# EAGLE design mixtape2 (EAGLE 6.49)
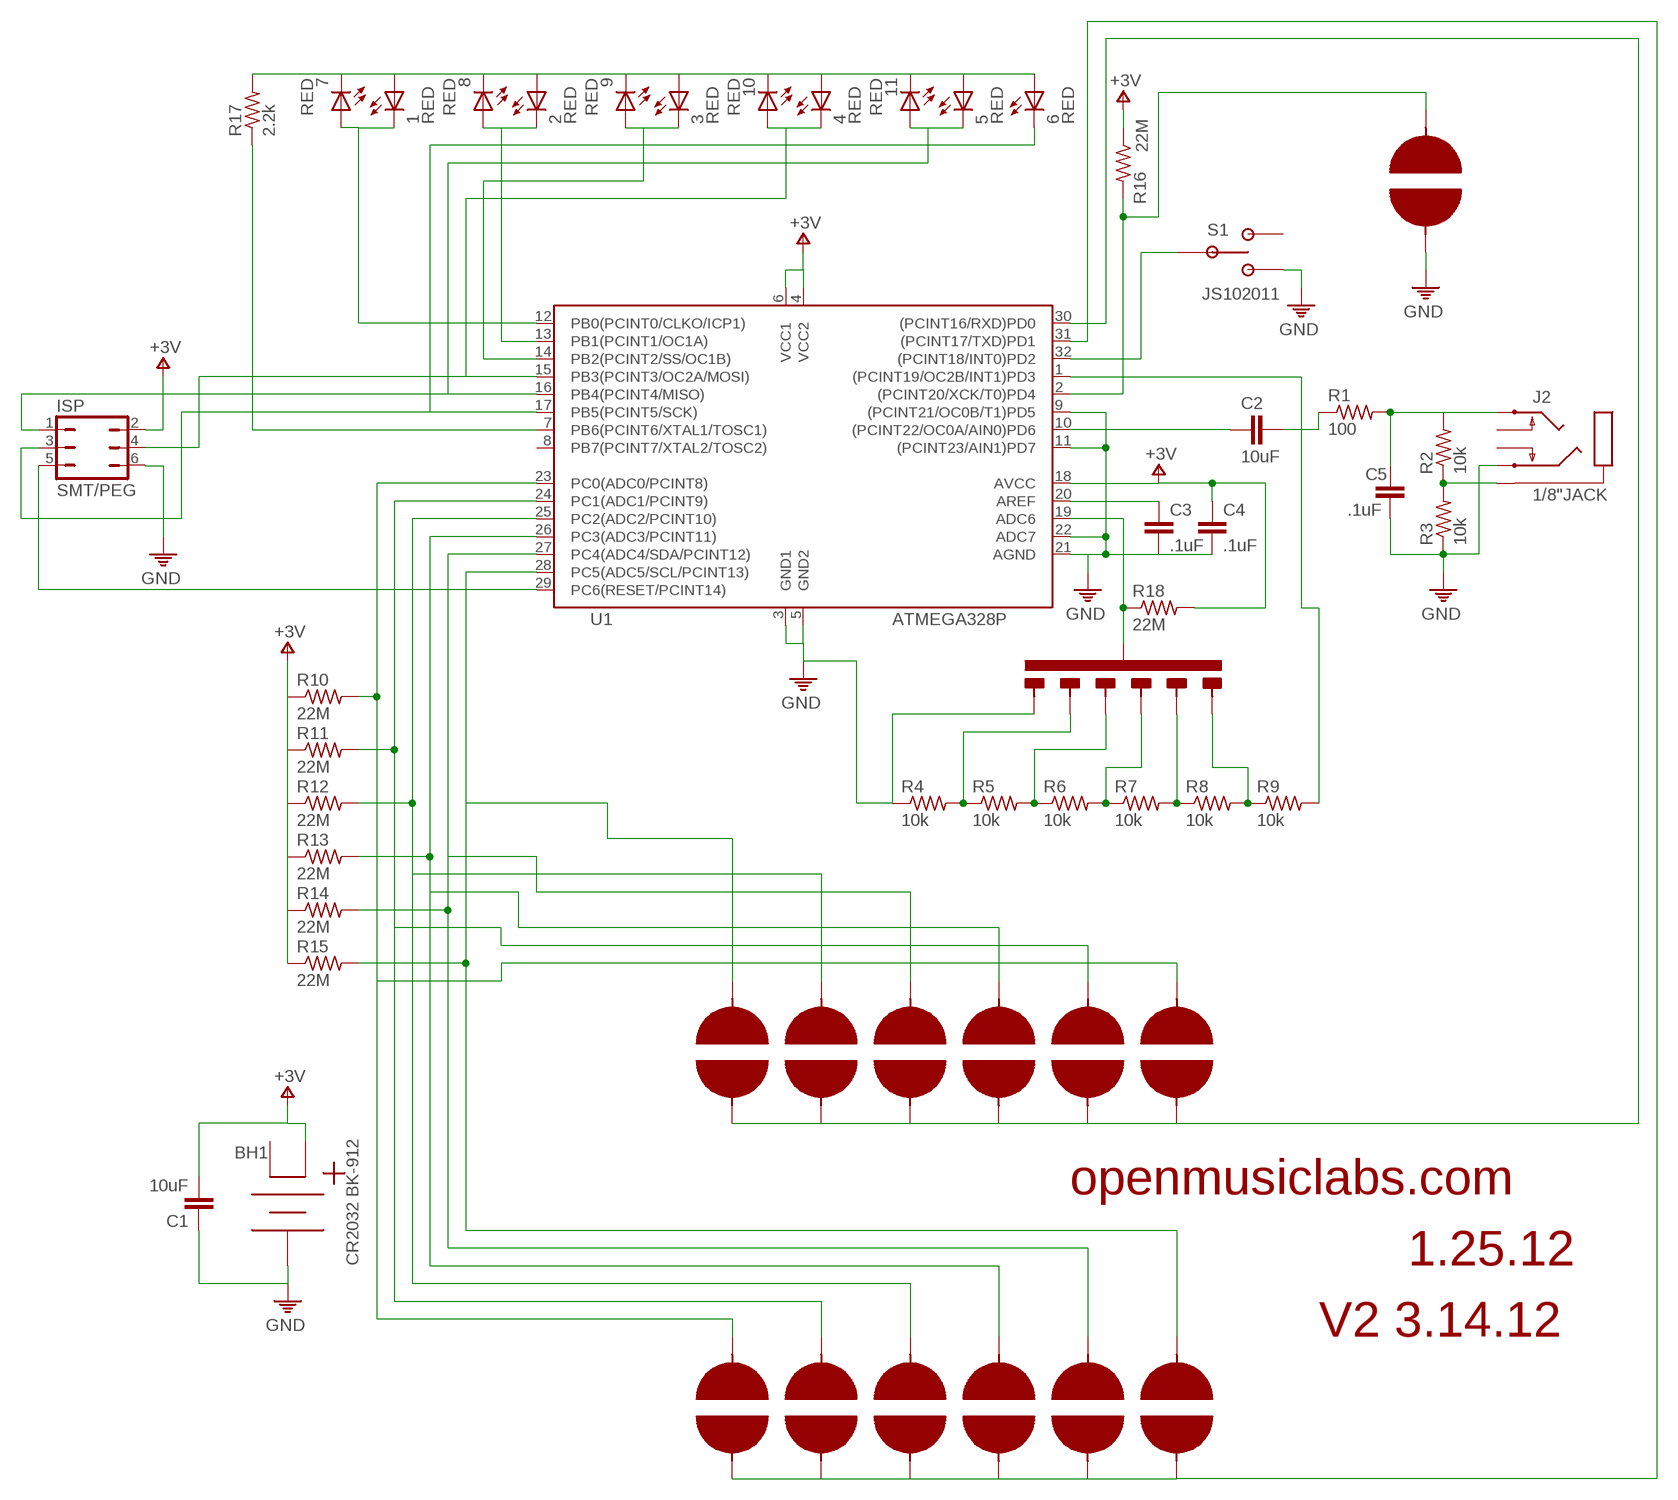
[diagram p0: schematic, sheet 1]

## Parts
1  RED  LEDLUMEX-92-21  [LED-SMT-91-21]
2  RED  LEDLUMEX-92-21  [LED-SMT-91-21]
3  RED  LEDLUMEX-92-21  [LED-SMT-91-21]
4  RED  LEDLUMEX-92-21  [LED-SMT-91-21]
5  RED  LEDLUMEX-92-21  [LED-SMT-91-21]
6  RED  LEDLUMEX-92-21  [LED-SMT-91-21]
7  RED  LEDLUMEX-92-21  [LED-SMT-91-21]
8  RED  LEDLUMEX-92-21  [LED-SMT-91-21]
9  RED  LEDLUMEX-92-21  [LED-SMT-91-21]
10  RED  LEDLUMEX-92-21  [LED-SMT-91-21]
11  RED  LEDLUMEX-92-21  [LED-SMT-91-21]
BH1  CR2032 BK-912  BAT-HOLDCR2032-BK-912  [BAT-HOLD-BK-912]
C1  10uF  CAPACITOR0805-SM  [0805/SMALL]
C2  10uF  CAPACITOR0805-SM  [0805/SMALL]
C3  .1uF  CAPACITOR0603=SM  [0603-SM]
C4  .1uF  CAPACITOR0603=SM  [0603-SM]
C5  .1uF  CAPACITOR0603=SM  [0603-SM]
ISP  SMT/PEG  JMP/6P/DIPSMT/PEG  [JMP/6P/DIP/SMT/PEG]
J2  1/8"JACK  1/8"JACK/STEREO/2SWITCHCUI3515/KOBICONN2805  [1/8"JACK/STEREO/SMT]
R1  100  RESISTOR0603-SM  [0603-SM]
R2  10k  RESISTOR0603-SM  [0603-SM]
R3  10k  RESISTOR0603-SM  [0603-SM]
R4  10k  RESISTOR0603-SM  [0603-SM]
R5  10k  RESISTOR0603-SM  [0603-SM]
R6  10k  RESISTOR0603-SM  [0603-SM]
R7  10k  RESISTOR0603-SM  [0603-SM]
R8  10k  RESISTOR0603-SM  [0603-SM]
R9  10k  RESISTOR0603-SM  [0603-SM]
R10  22M  RESISTOR0603-SM  [0603-SM]
R11  22M  RESISTOR0603-SM  [0603-SM]
R12  22M  RESISTOR0603-SM  [0603-SM]
R13  22M  RESISTOR0603-SM  [0603-SM]
R14  22M  RESISTOR0603-SM  [0603-SM]
R15  22M  RESISTOR0603-SM  [0603-SM]
R16  22M  RESISTOR0603-SM  [0603-SM]
R17  2.2k  RESISTOR0603-SM  [0603-SM]
R18  22M  RESISTOR0603-SM  [0603-SM]
S1  JS102011  SWITCH/SPDT/NOMECHJS102011  [SWITCH/SLIDE/JS102011]
U1  ATMEGA328P  [32-TQFP-NOMOD]
U$1  PAD/TOUCH/WHEEL  [PAD/TOUCH/WHEEL]
U$2  PAD/TOUCH  [PAD/TOUCH/DOT]
U$3  PAD/TOUCH  [PAD/TOUCH/DOT]
U$4  PAD/TOUCH  [PAD/TOUCH/DOT]
U$5  PAD/TOUCH  [PAD/TOUCH/DOT]
U$6  PAD/TOUCH  [PAD/TOUCH/DOT]
U$7  PAD/TOUCH  [PAD/TOUCH/DOT]
U$8  PAD/TOUCH  [PAD/TOUCH/DOT]
U$9  PAD/TOUCH/SLIDERSLIDER  [PAD/TOUCH/SLIDER]

## Nets
N$1: R17.P$1 U1.7(PB6(PCINT6/XTAL1/TOSC1))
N$2: U1.31((PCINT17/TXD)PD1) U$2.P$2 U$3.P$2 U$4.P$2 U$5.P$2 U$6.P$2 U$7.P$2
N$3: R13.P$2 U1.26(PC3(ADC3/PCINT11)) U$1.P$7 U$5.P$1
N$4: U1.30((PCINT16/RXD)PD0) U$1.P$2 U$1.P$4 U$1.P$6 U$1.P$8 U$1.P$10 U$1.P$12
N$5: ISP.5 U1.29(PC6(RESET/PCINT14))
N$6: J2.P$1 R2.P$1 R3.P$2
N$7: C2.1 R1.P$1
N$8: C5.P$1 J2.P$5 R1.P$2 R2.P$2
N$9: C2.2 U1.10((PCINT22/OC0A/AIN0)PD6)
N$10: S1.P$2 U1.32((PCINT18/INT0)PD2)
N$11: C3.P$1 U1.20(AREF)
N$12: R4.P$2 R5.P$1 U$9.P$6
N$13: R5.P$2 R6.P$1 U$9.P$5
N$14: R6.P$2 R7.P$1 U$9.P$4
N$15: R8.P$2 R9.P$1 U$9.P$2
N$17: R9.P$2 U1.1((PCINT19/OC2B/INT1)PD3)
N$18: 1.P$1(C) 7.P$2(A) U1.12(PB0(PCINT0/CLKO/ICP1))
N$19: 2.P$1(C) 8.P$2(A) U1.13(PB1(PCINT1/OC1A))
N$20: 3.P$1(C) 9.P$2(A) U1.14(PB2(PCINT2/SS/OC1B))
N$21: 4.P$1(C) 10.P$2(A) ISP.4 U1.15(PB3(PCINT3/OC2A/MOSI))
N$22: 5.P$1(C) 11.P$2(A) ISP.1 U1.16(PB4(PCINT4/MISO))
N$23: 1.P$2(A) 2.P$2(A) 3.P$2(A) 4.P$2(A) 5.P$2(A) 6.P$2(A) 7.P$1(C) 8.P$1(C) 9.P$1(C) 10.P$1(C) 11.P$1(C) R17.P$2
N$24: R16.P$2 U1.2((PCINT20/XCK/T0)PD4) U$8.P$1
N$26: R12.P$2 U1.25(PC2(ADC2/PCINT10)) U$1.P$3 U$4.P$1
N$27: R14.P$2 U1.27(PC4(ADC4/SDA/PCINT12)) U$1.P$5 U$6.P$1
N$30: R15.P$2 U1.28(PC5(ADC5/SCL/PCINT13)) U$1.P$1 U$7.P$1
N$31: R18.P$1 U1.19(ADC6) U$9.P$1
N$32: 6.P$1(C) ISP.3 U1.17(PB5(PCINT5/SCK))
N$35: R11.P$2 U1.24(PC1(ADC1/PCINT9)) U$1.P$9 U$3.P$1
N$37: R10.P$2 U1.23(PC0(ADC0/PCINT8)) U$1.P$11 U$2.P$1
N$100: R7.P$2 R8.P$1 U$9.P$3
PE: BH1.P$3 C1.1 C3.P$2 C4.P$2 C5.P$2 ISP.6 J2.P$3 R3.P$1 R4.P$1 S1.P$1 U1.3(GND1) U1.5(GND2) U1.9((PCINT21/OC0B/T1)PD5) U1.11((PCINT23/AIN1)PD7) U1.21(AGND) U1.22(ADC7) U$8.P$2 U$9.P$7 ; supply symbol labelled GND
V+: BH1.P$1 C1.2 C4.P$1 ISP.2 R10.P$1 R11.P$1 R12.P$1 R13.P$1 R14.P$1 R15.P$1 R16.P$1 R18.P$2 U1.4(VCC2) U1.6(VCC1) U1.18(AVCC) ; supply symbol labelled +3V
Unconnected: BH1.P$2 J2.P$2 J2.P$4 S1.P$3 U1.8(PB7(PCINT7/XTAL2/TOSC2))

## Notes on the sheet
- openmusiclabs.com
- 1.25.12
- V2 3.14.12

## Library data of the parts
1-11 = audioint:LED
BH1 = audioint:BAT-HOLD
C1-C5 = audioint:CAPACITOR
ISP = audioint:JMP/6P/DIP
J2 = audioint:1/8"JACK/STEREO/2SWITCH
R1-R18 = audioint:RESISTOR
S1 = audioint:SWITCH/SPDT/NOMECH
U1 = audioint:ATMEGA328P
U$1 = audioint:PAD/TOUCH/WHEEL
U$2-U$8 = audioint:PAD/TOUCH
U$9 = audioint:PAD/TOUCH/SLIDER

## Board
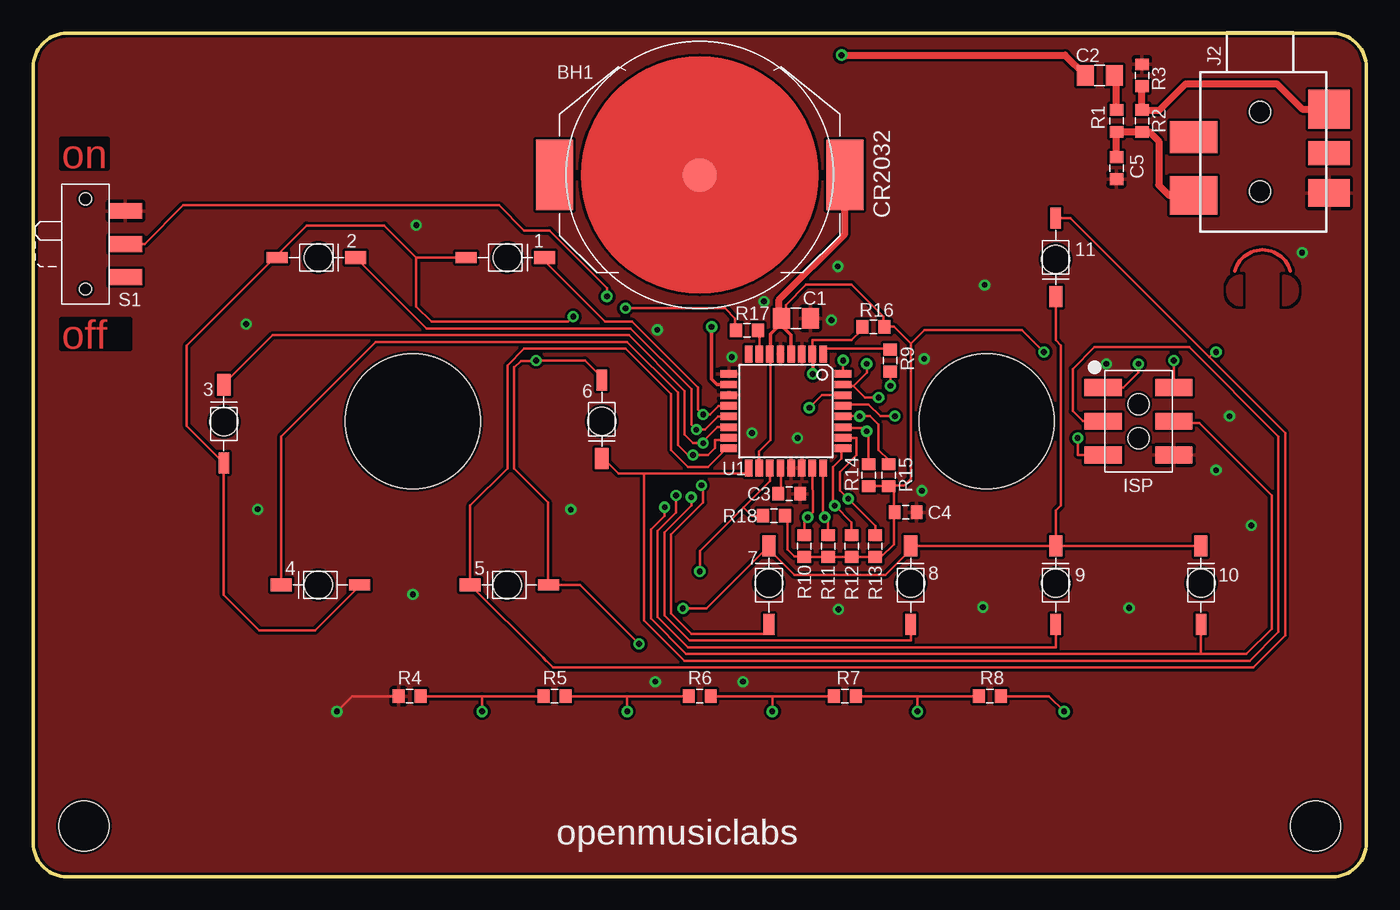
[diagram p1: board, top side]
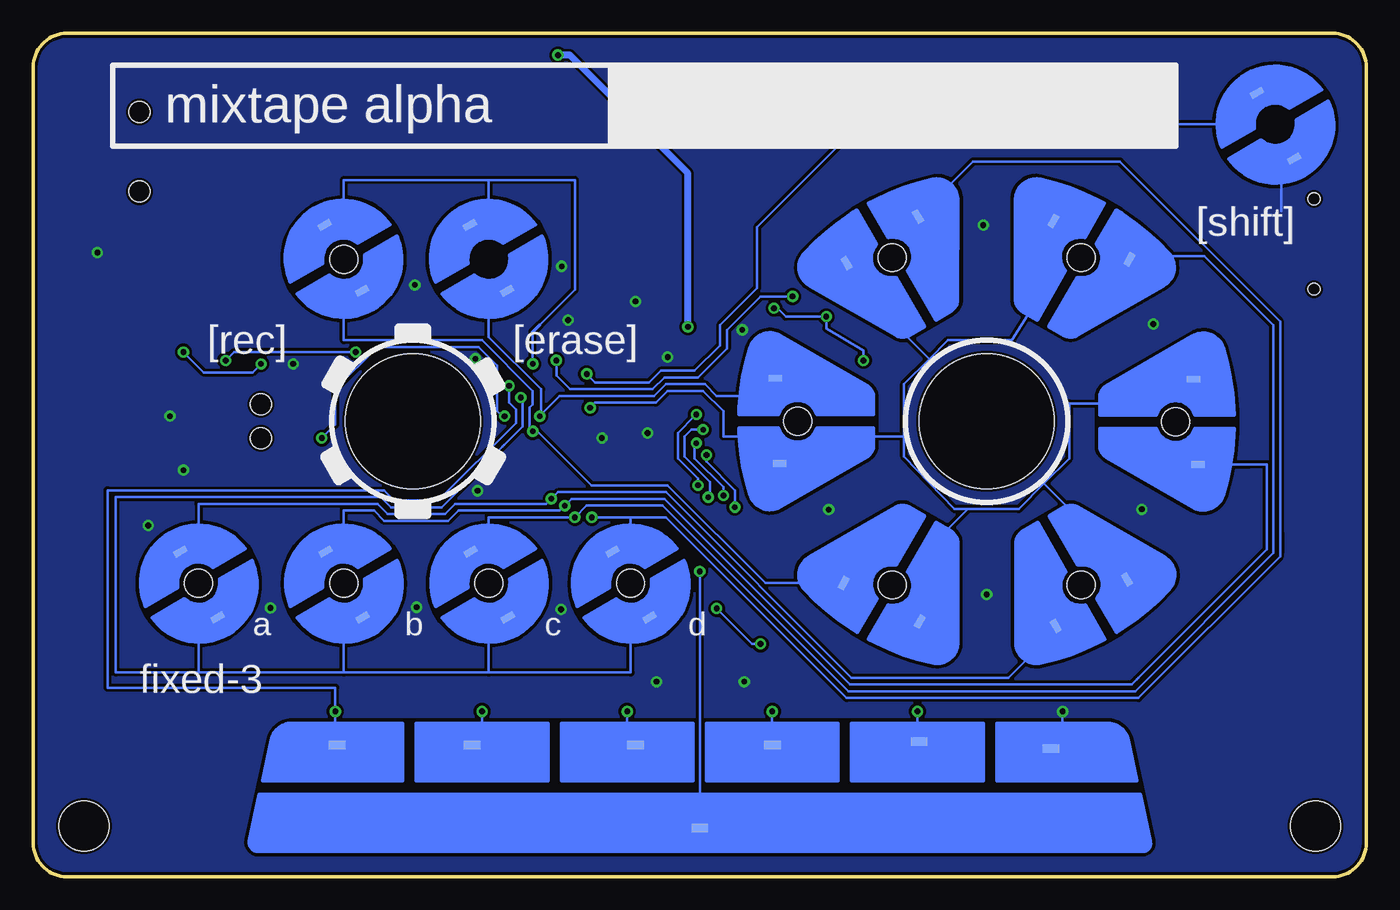
[diagram p2: board, bottom side, seen from below]

Size 100.33 x 63.5 mm. Coordinates in mm from the lower left corner, seen from the top.
Outline: 100.33,60.96 arc90 97.79,63.5 2.54,63.5 arc90 0,60.96 0,2.54 arc90 2.54,0 97.79,0 arc90 100.33,2.54 100.33,60.96
Copper layers (1*16): Top 0.035mm / dielectric 1.5mm / Bottom 0.035mm
Design rules "default": minimum track width 8mil, minimum drill 16mil, track to track 8mil, track to pad 8mil, pad to pad 8mil, via to via 8mil, smd to smd 8mil, copper to edge 8mil, drill to drill 8mil, minimum pad ring 8mil, minimum via ring 8mil, stop-mask expansion 4mil, vias tented up to drill 100mil, thermal gap 10mil
Holes 10.16 mm at 28.57,34.29 71.75,34.29
Holes 3.78 mm at 3.81,3.81 96.52,3.81

### Footprints (pad centres in the part's own frame; a part is rotated, then mirrored left to right if it is on the bottom)
LED-SMT-91-21 = smd 1.6 x 1: P$1 -2.8,0 | smd 1.6 x 0.8: P$2 3.1,0 | hole 2.108: 0,0
BAT-HOLD-BK-912 = smd 2.794 x 5.334: P$1 -10.922,0; P$2 10.922,0 | smd 2.54 x 2.54: P$3 0,0
0805/SMALL = smd 1.27 x 1.524: 1 -1.091,0; 2 1.091,0
0603-SM = smd 0.889 x 1.016: P$1 -0.826,0; P$2 0.826,0
JMP/6P/DIP/SMT/PEG = smd 1.27 x 2.794: 1 -2.54,-2.667; 2 -2.54,2.667; 3 0,-2.667; 4 0,2.667; 5 2.54,-2.667; 6 2.54,2.667 | hole 1.6: -1.27,0; 1.27,0
1/8"JACK/STEREO/SMT = smd 3.1 x 2.9: P$1 5.2,-2.8 | smd 3.1 x 1.8: P$2 5.2,-6.1 | smd 3.1 x 2.1: P$3 5.2,-9.1 | smd 3.6 x 2.4: P$4 -5,-4.9 | smd 3.6 x 2.9: P$5 -5,-9.3 | hole 1.6: 0,-9; 0,-3
SWITCH/SLIDE/JS102011 = smd 1.2 x 2.5: P$1 -2.5,3; P$2 0,3; P$3 2.5,3 | hole 0.889: -3.4,0; 3.4,0
32-TQFP-NOMOD = smd 1.27 x 0.559: 1 -4.293,2.8; 2 -4.293,2; 3 -4.293,1.2; 4 -4.293,0.4; 5 -4.293,-0.4; 6 -4.293,-1.2; 7 -4.293,-2; 8 -4.293,-2.8; 17 4.293,-2.8; 18 4.293,-2; 19 4.293,-1.2; 20 4.293,-0.4; 21 4.293,0.4; 22 4.293,1.2; 23 4.293,2; 24 4.293,2.8 | smd 0.559 x 1.27: 9 -2.8,-4.293; 10 -2,-4.293; 11 -1.2,-4.293; 12 -0.4,-4.293; 13 0.4,-4.293; 14 1.2,-4.293; 15 2,-4.293; 16 2.8,-4.293; 25 2.8,4.293; 26 2,4.293; 27 1.2,4.293; 28 0.4,4.293; 29 -0.4,4.293; 30 -1.2,4.293; 31 -2,4.293; 32 -2.8,4.293
PAD/TOUCH/WHEEL = smd 1.016 x 0.508: P$1 -15.926,3.226; P$2 -15.57,-3.175; P$3 15.926,-3.251; P$4 15.57,3.15 | smd 1.016 x 0.508 rotated 60: P$5 -10.753,-12.187; P$6 -5.032,-15.079 | smd 1.016 x 0.508 rotated 120: P$7 5.198,-15.413; P$8 10.564,-11.904 | smd 1.016 x 0.508 rotated 240: P$9 10.753,12.187; P$10 5.032,15.079 | smd 1.016 x 0.508 rotated 300: P$11 -5.173,15.413; P$12 -10.538,11.904
PAD/TOUCH/DOT = smd 1.016 x 0.508 rotated 30: P$1 -1.371,2.376; P$2 1.429,-2.577
PAD/TOUCH/SLIDER = smd 1.27 x 0.635: P$1 0,-3.048; P$2 -27.305,3.175; P$3 -17.145,3.175; P$4 -4.826,3.175; P$5 5.461,3.175; P$6 16.51,3.429; P$7 26.416,2.921

### Placement (x,y rotation side)
1  35.69,46.61 180 top
2  21.46,46.61 180 top
3  14.35,34.24 270 top
4  21.46,21.97 0 top
5  35.69,21.97 0 top
6  42.8,34.29 90 top
7  55.37,22.1 270 top
8  66.04,22.1 270 top
9  76.96,22.1 270 top
10  87.88,22.1 270 top
11  76.96,46.48 90 top
BH1  50.16,52.83 180 top
C1  57.4,42.04 180 top
C2  80.26,60.33 180 top
C3  56.9,28.83 0 top
C4  65.66,27.43 0 top
C5  81.53,53.34 270 top
ISP  83.19,34.29 270 top
J2  92.33,60.58 0 top
R1  81.53,56.9 270 top
R2  83.44,56.9 270 top
R3  83.44,60.33 270 top
R4  28.32,13.59 0 top
R5  39.24,13.59 0 top
R6  50.16,13.59 0 top
R7  61.09,13.59 0 top
R8  72.01,13.59 0 top
R9  64.52,38.86 90 top
R10  58.04,24.89 90 top
R11  59.82,24.89 90 top
R12  61.59,24.89 90 top
R13  63.37,24.89 90 top
R14  62.87,30.23 90 top
R15  64.39,30.23 90 top
R16  63.25,41.4 180 top
R17  100  [0603-SM]  53.72,41.15 180 top
R18  55.75,27.18 0 top
S1  3.94,47.62 270 top
U1  56.64,35.05 270 top
U$1  28.57,34.29 0 bottom
U$2  55.37,22.1 0 bottom
U$3  66.04,22.1 0 bottom
U$4  76.96,22.1 0 bottom
U$5  87.88,22.1 0 bottom
U$6  76.96,46.48 180 bottom
U$7  66.04,46.48 180 bottom
U$8  6.86,56.64 0 bottom
U$9  50.16,6.73 0 bottom

### Tracks (layer width: path | path; a pad name or v marks a point on that pad's centre or on a via)
N$1
  Top 0.203: R17.P$1 54.55,41.08 54.61,41.15 54.64,41.12 U1.7
N$2  (via drill 0.43, 0.43 pad 0.86)
  Top 0.203: U1.31 60.94,36.96 61.72,36.96 | v62.74,38.61 62.74,37.97 61.72,36.96 | v63.63,36.07 62.61,36.07 61.72,36.96
  Bottom 0.203: U$7.P$2 66.04,49.06 66.04,52.45 | 78.36,49.06 78.36,49.02 | 78.36,49.06 U$6.P$2 | 78.36,49.06 78.36,49.15 76.96,49.15 76.96,52.45 66.04,52.45 | U$2.P$2 55.37,19.52 55.37,15.37 66.04,15.37 | 86.36,19.52 86.36,19.56 | 86.36,19.52 U$5.P$2 | 86.36,19.52 86.36,18.16 87.88,18.16 87.88,15.37 88.01,15.37 | U$3.P$2 66.04,19.52 66.04,15.37 | 66.04,52.45 59.56,52.45 59.56,44.2 62.23,41.53 | v62.74,38.61 62.74,41.02 | 88.01,15.37 94.11,15.37 94.11,28.57 74.17,28.57 73.41,27.81 69.6,27.81 65.02,32.38 | 65.02,32.38 64.9,32.51 | 66.04,15.37 76.96,15.37 | 76.96,15.37 88.01,15.37 | U$4.P$2 76.96,19.52 76.96,15.37 | 65.02,32.38 63.5,33.91 63.5,35.43 63.5,35.94 v63.63,36.07
  Bottom 0.254: 62.74,41.02 62.23,41.53
N$3  (via drill 0.43 pad 0.86)
  Top 0.203: 60.55,33.02 60.45,33.02 | 60.55,33.02 U1.26 | 60.55,33.02 61.98,33.02 61.98,31.75 60.71,30.48 60.71,29.08 v61.34,28.45 63.37,26.42 R13.P$2
  Bottom 0.203: U$5.P$1 87.88,24.47 87.88,28.07 74.42,28.07 73.66,27.3 69.34,27.3 68.58,28.07 61.72,28.07 v61.34,28.45 60.83,28.96 52.7,28.96 38.73,14.99 26.92,14.99 23.45,18.46 23.45,20.15 | 23.45,20.15 U$1.P$7 | 23.45,20.15 22.99,19.68
N$4  (via drill 0.43 pad 0.86)
  Top 0.203: U1.30 59.37,36.25 v58.42,35.31
  Bottom 0.203: U$1.P$10 23.62,49.4 23.24,45.47 23.62,45.47 23.62,45.21 26.67,40.39 31.5,40.39 32.89,38.99 | U$1.P$12 38.95,46.19 35.94,44.2 35.94,42.04 32.89,38.99 | U$1.P$6 33.15,19.67 33.15,21.34 | 33.15,21.34 33.15,23.24 | U$1.P$8 20.83,24.26 | 20.83,24.26 20.7,24.51 | 32.89,38.99 34.8,37.08 34.8,33.15 | 22.35,35.33 22.35,31.5 24.26,29.59 | 22.35,35.33 22.35,35.56 | 34.8,33.15 40.01,33.15 40.64,32.51 40.64,31.11 U$1.P$2 46.18,33.15 48.39,33.15 48.39,35.05 49.91,36.58 52.58,36.58 53.47,35.69 58.04,35.69 v58.42,35.31 | 34.8,33.15 34.8,31.62 30.99,27.69 29.97,27.69 | 29.97,27.69 26.16,27.69 24.26,29.59 | 20.83,24.26 20.95,24.13 20.95,26.29 24.26,29.59 | 33.15,21.34 33.4,21.34 | 33.15,21.34 33.15,24.51 29.97,27.69 | 16.61,35.64 22.35,35.64 22.35,35.33
  Bottom 0.254: U$1.P$4 16.61,37.44 16.61,35.64
N$5  (via drill 0.43)
  Top 0.203: U1.29 61.04,35.56 62.87,35.56 63.75,34.67 v64.85,34.67 | ISP.5 78.61,31.75 v78.61,33.02
  Bottom 0.203: 64.9,34.67 v64.85,34.67 65.02,34.67 65.41,35.05 65.41,38.48 66.8,39.88 74.42,39.88 77.6,36.7 77.6,34.04 v78.61,33.02
N$6
  Top 0.508: J2.P$1 arc-90 J2.P$1 | J2.P$1 arc-90 97.47,57.72 | R2.P$1 83.44,57.66 | R2.P$1 R3.P$2 | R2.P$1 84.77,57.72 86.74,59.69 93.6,59.69 95.5,57.78 J2.P$1 | J2.P$1 | J2.P$1
N$7
  Top 0.508: 81.53,57.66 R1.P$1 81.53,60.33 C2.1
N$8
  Top 0.508: 83.5,56.07 arc-90 83.57,56.01 arc90 83.5,56.07 | R2.P$2 83.5,56.07 | R2.P$2 R1.P$2 C5.P$1 | R2.P$2 84.01,56.07 84.71,55.37 84.71,52.07 85.47,51.31 87.25,51.31 arc-90 87.38,51.18 arc-90 87.33,51.23 J2.P$5
N$9  (via drill 0.43 pad 0.86)
  Top 0.254: U1.10 52.04,37.05 | 52.04,37.05 51.47,37.05 51.05,37.47 v51.05,41.4 | 52.04,37.05 52.07,37.08
  Top 0.508: C2.2 79.12,60.33 | C2.2 79.25,60.33 | C2.2 77.65,61.85 v60.83,61.85
  Bottom 0.508: v51.05,41.4 51.05,52.96 59.94,61.85 v60.83,61.85
N$10  (via drill 0.43 pad 0.86)
  Top 0.203: S1.P$2 8.38,47.62 11.3,50.55 35.05,50.55 36.96,48.64 38.86,48.64 43.18,44.32 v43.18,43.69 | 60.84,37.85 U1.32 60.96,37.85 v60.96,38.86
  Bottom 0.203: v43.18,43.69 45.59,43.69 48.13,41.15 48.13,39.75 50.29,37.59 52.83,37.59 53.72,36.7 59.94,36.7 60.96,37.72 v60.96,38.86
N$11
  Top 0.203: C3.P$1 56.26,28.83 56.26,30.74 U1.20
N$12  (via drill 0.43 pad 0.86)
  Top 0.203: R4.P$2 33.78,13.59 | 33.78,13.59 R5.P$1 | 33.78,13.59 v33.78,12.45
  Bottom 0.203: v33.78,12.45 33.78,10.52 33.78,10.29
  Bottom 0.406: 33.78,10.52 33.68,10.52 33.68,10.16 U$9.P$6
N$13  (via drill 0.43 pad 0.86)
  Top 0.203: 49.4,13.59 R6.P$1 44.7,13.59 | R5.P$2 44.7,13.59 | 44.7,13.59 v44.7,12.45
  Bottom 0.203: 44.73,12.45 44.73,12.52 | v44.7,12.45 44.73,12.45 | U$9.P$5 44.73,9.91 44.73,12.45
N$14  (via drill 0.43 pad 0.86)
  Top 0.203: v55.63,12.45 55.63,13.59 | 51,13.59 R6.P$2 50.65,13.59 | 55.63,13.59 51,13.59 | 55.63,13.59 R7.P$1 | 51,13.59 51,13.61 | 55.63,13.59 50.65,13.59 | 50.65,13.59 50.65,13.51
  Bottom 0.203: U$9.P$4 55.63,10.54 v55.63,12.45
N$15  (via drill 0.43 pad 0.86)
  Top 0.203: v77.6,12.45 76.45,13.59 72.75,13.59 | 72.75,13.59 R8.P$2 | 72.75,13.59 72.75,13.61 | 64.52,38.08 R9.P$1 v64.52,36.96
  Bottom 0.203: U$9.P$2 77.6,10.03 v77.6,12.45 77.6,14.22 94.74,14.22 94.74,29.08 73.91,29.08 73.15,28.32 69.85,28.32 64.01,34.16 64.01,35.18 64.52,35.69 v64.52,36.96
N$16
  pour Top: 90.93,43.05 90.93,45.21 arc90 89.92,44.32 89.92,44.07 arc90
  pour Top: 94.11,43.05 94.11,45.21 arc-90 95.12,44.2 95.12,44.07 arc-90
N$17
  Top 0.203: R9.P$2 64.52,39.75 59.44,39.75 U1.1
N$18  (via drill 0.43)
  Top 0.203: 38.35,46.61 1.P$1 38.61,46.61 38.61,46.23 43.05,41.78 45.09,41.78 50.04,36.83 50.04,35.18 v50.42,34.8 50.93,34.8 51.56,35.43 51.99,35.43 | 51.99,35.43 52.2,35.43 | 51.99,35.43 U1.12 | 7.P$2 55.37,18.29 49.53,18.29 48.01,19.81 48.01,25.78 50.42,28.19 50.42,29.34 v50.29,29.46
  Bottom 0.203: v50.42,34.8 50.55,34.8 50.55,34.67 51.82,33.4 51.82,31.5 50.29,29.97 v50.29,29.46
N$19  (via drill 0.43)
  Top 0.203: 8.P$2 66.04,17.78 49.4,17.78 47.5,19.68 47.5,25.91 49.53,27.94 v49.53,28.57 | 52.33,34.67 U1.13 51.54,34.65 50.55,33.66 v49.91,33.66 49.53,34.04 49.53,36.7 44.96,41.27 29.6,41.27 2.P$1
  Bottom 0.203: v49.91,33.66 50.8,33.66 51.31,33.15 51.31,31.62 49.4,29.72 49.4,28.7 v49.53,28.57
N$20  (via drill 0.43)
  Top 0.203: 3.P$1 14.35,37.08 18.03,40.77 44.83,40.77 49.02,36.58 49.02,33.27 49.66,32.64 v50.42,32.64 50.42,32.77 51.51,33.85 U1.14 | 9.P$2 76.96,17.27 49.28,17.27 46.99,19.56 46.99,25.15 | 46.99,25.15 46.99,25.4 | 46.99,25.15 46.99,26.04 48.39,27.43 v48.39,28.7
  Bottom 0.203: v50.42,32.64 50.55,32.51 50.55,31.5 48.39,29.34 v48.39,28.7
N$21  (via drill 0.43)
  Top 0.203: 4.P$1 18.66,33.14 25.78,40.26 44.7,40.26 48.51,36.45 48.51,32.51 49.28,31.75 49.78,31.75 | 87.88,16.76 49.15,16.76 46.48,19.43 46.48,26.16 47.5,27.18 47.5,27.81 v47.52,27.81 | U1.15 52.19,32.89 51.31,32.89 51.31,32.26 50.8,31.75 49.78,31.75 | 49.78,31.75 v49.66,31.75 | 87.88,16.76 10.P$2 | 87.88,16.76 91.31,16.76 93.22,18.67 93.22,28.7 87.76,34.16 85.98,34.16 ISP.4
  Bottom 0.203: v49.66,31.75 49.66,31.24 47.5,29.08 47.5,27.81 v47.52,27.81
N$22  (via drill 0.43)
  Top 0.203: 5.P$1 32.89,27.94 35.69,30.73 35.69,38.48 36.96,39.75 44.58,39.75 48.01,36.32 48.01,32.13 49.28,30.86 50.8,30.86 52.2,32.26 52.2,32.25 U1.16 52.35,32.13 52.45,32.13 | 5.P$1 | 5.P$1 38.35,16.51 | 38.35,16.51 38.61,16.26 | 76.96,49.53 11.P$2 78.05,49.58 88.52,39.12 | 38.35,16.51 39.12,15.75 91.82,15.75 94.23,18.16 94.23,33.4 88.52,39.12 | v89.03,39.5 89.03,39.62 88.52,39.12 | ISP.1 82.04,36.83 83.19,37.97 83.19,38.48 83.31,38.61 v83.19,38.61
  Bottom 0.203: v89.03,39.5 87.5,37.97 83.82,37.97 v83.19,38.61
N$23  (via drill 0.43)
  Top 0.203: 88.01,24.9 88.01,25.02 | 77.09,24.9 77.09,24.89 | 77.09,24.9 9.P$1 8.P$1 66.04,24.64 64.14,22.73 57.28,22.73 55.37,24.64 7.P$1 50.67,20.19 v48.9,20.19 | 77.09,24.9 10.P$1 88.01,24.9 | 88.01,24.9 88.01,24.64 | 28.83,46.61 1.P$2 | 28.83,46.61 26.42,49.02 20.57,49.02 18.29,46.74 | 2.P$2 18.16,46.61 18.29,46.74 | 18.29,46.74 11.56,40.01 11.56,33.93 3.P$2 14.35,21.21 17.02,18.54 21.21,18.54 24.64,21.97 4.P$2 | 5.P$2 38.86,21.97 | 6.P$2 42.8,37.59 41.53,38.86 v37.85,38.86 37.82,38.84 36.7,38.84 36.21,38.34 | 6.P$2 42.8,37.08 | 6.P$2 43,37.39 | v40.64,42.16 40.26,41.78 29.97,41.78 28.83,42.93 28.83,46.61 | 36.21,38.34 36.2,38.33 | 38.73,21.92 38.73,21.84 | 38.73,21.92 5.P$2 | 38.73,21.97 38.73,28.19 36.2,30.73 36.2,38.35 36.21,38.34 | 38.73,21.97 38.73,21.92 | 44.83,42.8 v44.58,42.8 52.07,42.8 52.83,42.04 52.83,41.02 52.9,41.08 R17.P$2 53.09,41.15 | 38.73,21.97 5.P$2 | 38.73,21.97 39.75,21.97 | 39.75,21.97 39.88,21.97 | v45.59,17.53 41.15,21.97 39.75,21.97 | 11.P$1 76.96,40.39 77.34,40.01 77.34,27.94 76.96,27.56 76.96,25.15 77.09,25.02 77.09,24.9
  Bottom 0.203: v37.85,38.86 37.85,39.62 40.64,41.27 v40.64,42.16 43.69,42.16 44.32,42.8 v44.58,42.8 | v45.59,17.53 46.23,17.53 v48.9,20.19
N$24  (via drill 0.43 pad 0.86)
  Top 0.203: U1.2 58.64,40.39 61.59,40.39 62.36,41.15 R16.P$2
  Top 0.254: 58.67,39.38 58.67,39.5 | 58.67,39.38 U1.2 | v58.67,37.85 58.67,39.38
  Bottom 0.203: U$8.P$1 8.23,57.94 9.14,57.02 | 9.14,56.64 38.1,56.64 45.85,48.9 45.85,44.32 48.64,41.53 48.64,40.01 50.55,38.1 53.09,38.1 53.98,37.21 58.04,37.21 v58.67,37.85
  Bottom 0.254: 9.14,56.64 9.14,57.02
N$25
  Top 0.254: 90.42,45.59 arc-149 94.61,45.59
N$26  (via drill 0.43 pad 0.86)
  Top 0.203: U1.25 60.58,32.25 60.58,32.38 60.83,32.38 60.83,31.5 60.2,30.86 60.2,28.07 v60.33,27.94 61.59,26.67 R12.P$2
  Bottom 0.203: U$4.P$1 76.96,24.47 76.96,27.56 74.68,27.56 73.91,26.8 69.09,26.8 68.33,27.56 60.71,27.56 v60.33,27.94 59.82,28.45 52.83,28.45 38.86,14.48 17.65,14.48 17.14,14.99 | 8.76,31.04 U$1.P$3 7.49,31.04 7.49,24.64 17.14,14.99 | 17.14,14.99 17.27,14.86
N$27  (via drill 0.43 pad 0.86)
  Top 0.203: 60.58,33.78 61.47,33.78 | R14.P$2 62.87,33.53 v62.74,33.53 62.48,33.78 60.58,33.78 | 60.58,33.78 60.58,33.83 U1.27
  Bottom 0.203: U$6.P$1 76.96,44.11 76.96,40.39 66.55,40.39 62.74,36.58 62.74,35.56 62.99,35.31 62.99,33.78 v62.74,33.53 62.36,33.53 58.29,29.46 52.58,29.46 45.22,22.1 U$1.P$5
N$30  (via drill 0.43 pad 0.86)
  Top 0.203: U1.28 60.57,34.67 v62.2,34.67 62.99,34.67 63.63,34.04 63.63,32.13 64.39,31.37 R15.P$2 64.39,30.99
  Bottom 0.203: U$7.P$1 66.04,44.11 66.04,40.64 62.1,36.7 62.1,34.67 | 44.45,37.52 44.45,37.59 | 44.45,37.52 U$1.P$1 | 44.45,35.05 44.45,36.7 | 44.45,36.7 44.45,37.52 | 44.45,36.7 44.45,35.69 | 44.45,36.7 44.96,36.2 48.9,36.2 49.78,37.08 52.7,37.08 53.59,36.2 60.71,36.2 62.1,34.8 62.1,34.67 | 62.36,34.8 v62.2,34.67 62.1,34.67
N$31  (via drill 0.43)
  Top 0.203: U1.19 55.44,29.79 53.47,27.81 | 53.47,27.81 50.16,24.51 v50.16,22.99 | R18.P$1 54.1,27.18 53.47,27.81
  Bottom 0.203: 50.16,3.56 U$9.P$1 v50.16,22.99
N$32
  Top 0.203: 6.P$1 42.92,31.49 42.93,31.5 44.07,30.35 47.24,30.35 | 47.24,30.35 53.85,30.35 53.84,30.36 U1.17 53.84,30.35 47.24,30.35 | 47.24,30.35 45.97,30.35 45.97,25.78 | 45.97,25.78 45.97,25.65 | 45.97,25.78 45.97,19.3 49.02,16.26 91.57,16.26 93.73,18.41 93.73,33.15 87,39.88 79.88,39.88 78.23,38.23 78.23,35.05 78.99,34.29 80.64,34.29 | 80.64,34.29 ISP.3 | 80.64,34.29 80.77,34.42
N$35  (via drill 0.43 pad 0.86)
  Top 0.203: U1.24 59.44,30.38 59.44,27.18 v59.56,27.05 59.82,26.8 R11.P$2
  Bottom 0.203: U$3.P$1 66.04,24.47 66.04,27.05 v59.56,27.05 58.67,27.94 52.96,27.94 38.99,13.97 17.4,13.97 6.99,24.38 6.99,41.53 12.19,46.74 18.03,46.74 U$1.P$9
N$37  (via drill 0.43 pad 0.86)
  Top 0.203: U1.23 58.67,27.46 v58.29,27.05 58.04,26.8 R10.P$2 58.04,25.65
  Bottom 0.203: U$2.P$1 55.37,25.84 55.37,27.05 | 55.37,27.05 v58.29,27.05 | 6.48,25.91 6.48,24.38 | 6.48,25.91 6.48,41.78 18.54,53.85 29.6,53.85 U$1.P$11 | 6.48,25.91 6.48,24.13 17.14,13.46 39.12,13.46 52.7,27.05 55.37,27.05
N$100  (via drill 0.43 pad 0.86)
  Top 0.203: 66.55,13.59 R7.P$2 | 66.55,13.59 R8.P$1 | v66.55,12.45 66.55,13.59
  Bottom 0.203: v66.55,12.45 66.55,10.77 66.55,10.67
  Bottom 0.406: U$9.P$3 66.55,9.91 66.55,10.77
PE  (via drill 0.43, 0.43 pad 0.86)
  Top 0.203: 27.56,13.59 R4.P$1 24,13.59 v22.86,12.45
  Bottom 0.203: 22.86,9.65 v22.86,12.45 | U$8.P$2 6.4,53.09 6.4,50.11
  Bottom 0.406: 22.78,9.65 22.86,9.65 | 22.78,9.65 U$9.P$7 | 22.78,9.65 22.78,9.55
  other vias: 52.58,39.12 60.07,41.91 90.04,34.67 80.77,38.61 54.99,43.31 57.53,33.02 54.1,33.4 95.5,46.99 89.03,30.61 82.47,20.24 60.6,20.12 71.48,20.29 91.67,26.44 71.6,44.55 66.88,29.06 67.06,38.99 28.57,21.26 16.89,27.66 16.03,41.61 28.83,49.05 40.46,27.64 46.96,41.17 53.42,14.68 46.81,14.68 60.55,45.95
  pour Top (rank 3): 0,0 100.33,0 100.33,63.5 0,63.5
  pour Bottom (rank 3): 0,0 100.33,0 100.33,63.5 0,63.5
V+  (via drill 0.43)
  Top 0.203: 61.85,24.07 R13.P$1 63.82,24.07 64.77,25.02 64.77,27.3 | 61.85,24.07 61.66,24.07 | R10.P$1 57.98,24.07 57.91,24.13 | R10.P$1 R11.P$1 | R10.P$1 58.04,24.13 57.28,24.13 56.77,24.64 56.77,27.18 R18.P$2 | BH1.P$1 61.21,52.83 | R15.P$1 64.71,29.15 64.39,29.34 | R15.P$1 R14.P$1 | 55.5,39.24 55.5,32.89 54.61,32 54.61,30.86 54.64,30.83 U1.18 | 56.44,41.35 56.44,42.04 56.44,42.22 56.64,42.42 56.64,43.05 58.17,44.58 61.59,44.58 64.01,42.16 64.01,41.4 | R15.P$1 64.45,29.34 | 64.01,41.4 64.01,41.15 R16.P$1 64.01,41.4 | 66.04,40.13 66.04,29.97 65.53,29.46 64.45,29.46 R15.P$1 | 66.04,40.13 67.06,41.15 74.42,41.15 v76.07,39.5 | v85.85,38.86 ISP.2 | 64.77,27.3 64.77,27.37 C4.P$1 | 64.39,29.34 64.39,29.21 64.77,29.21 64.77,27.3 | 64.39,29.34 R15.P$1 | 66.04,40.13 64.77,41.4 64.01,41.4 | 61.85,24.07 61.85,24.13 61.78,24.07 R12.P$1 | R11.P$1 R12.P$1 | R11.P$1 59.82,24.13 59.88,24.07 R12.P$1
  Top 0.254: 55.5,39.29 55.5,39.24 | 55.5,39.29 U1.6 | 55.5,39.29 55.5,40.84 56.35,41.69 C1.2 56.34,41.9 56.44,41.35 | U1.4 57.04,39.26 57.02,39.24 57.02,40.77 56.39,41.4 56.39,42.04 56.44,42.04
  Top 0.508: 56.35,41.69 56.39,41.66 56.64,41.91 | BH1.P$1 61.09,48.39 56.13,43.43 56.13,42.16 56.39,41.91 56.38,41.9 56.34,41.9
  Bottom 0.203: v76.07,39.5 85.22,39.5 v85.85,38.86

### Text on the board
Top: on | off
tPlace: CR2032 | openmusiclabs
bPlace: mixtape alpha | [shift] | [erase] | [rec] | d | c | b | a | fixed-3
tStop: on | off